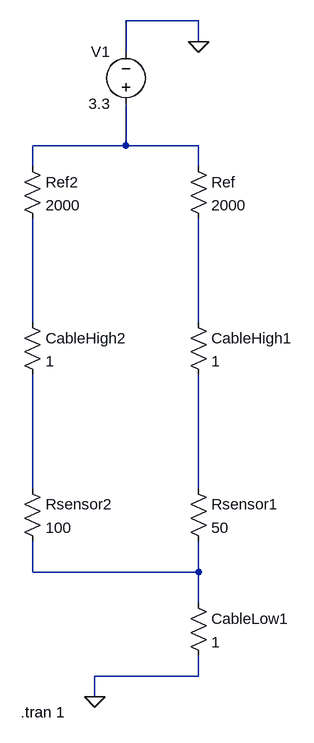
[diagram p0: schematic CommonGroundSensorCables.asc]
CommonGroundSensorCables.asc, the LTspice schematic file:
Version 4
SHEET 1 880 680
WIRE 224 -768 112 -768
WIRE 224 -736 224 -768
WIRE 112 -720 112 -768
WIRE 112 -576 112 -640
WIRE 112 -576 -32 -576
WIRE 224 -576 112 -576
WIRE -32 -544 -32 -576
WIRE 224 -544 224 -576
WIRE -32 -304 -32 -464
WIRE 224 -304 224 -464
WIRE -32 -48 -32 -224
WIRE 224 -48 224 -224
WIRE -32 80 -32 32
WIRE 224 80 224 32
WIRE 224 80 -32 80
WIRE 224 128 224 80
WIRE 224 240 224 208
WIRE 224 240 64 240
WIRE 64 272 64 240
FLAG 64 272 0
FLAG 224 -736 0
SYMBOL res 208 112 R0
SYMATTR InstName CableLow1
SYMATTR Value 1
SYMBOL res 208 -64 R0
SYMATTR InstName Rsensor1
SYMATTR Value 50
SYMBOL res 208 -320 R0
SYMATTR InstName CableHigh1
SYMATTR Value 1
SYMBOL res 208 -560 R0
SYMATTR InstName Ref
SYMATTR Value 2000
SYMBOL res -48 -64 R0
SYMATTR InstName Rsensor2
SYMATTR Value 100
SYMBOL res -48 -320 R0
SYMATTR InstName CableHigh2
SYMATTR Value 1
SYMBOL res -48 -560 R0
SYMATTR InstName Ref2
SYMATTR Value 2000
SYMBOL voltage 112 -624 R180
WINDOW 0 24 96 Left 2
WINDOW 3 24 16 Left 2
SYMATTR InstName V1
SYMATTR Value 3.3
TEXT -50 296 Left 2 !.tran 1

The netlist it stands for:
* CommonGroundSensorCables.asc
R§CableLow1 N006 0 1
Rsensor1 N005 N006 50
R§CableHigh1 N003 N005 1
Ref N001 N003 2000
Rsensor2 N004 N006 100
R§CableHigh2 N002 N004 1
Ref2 N001 N002 2000
V1 N001 0 3.3
.tran 1
.backanno
.end